# EAGLE design SparkFun_I2S_Audio_Breakout (EAGLE 9.1.1)
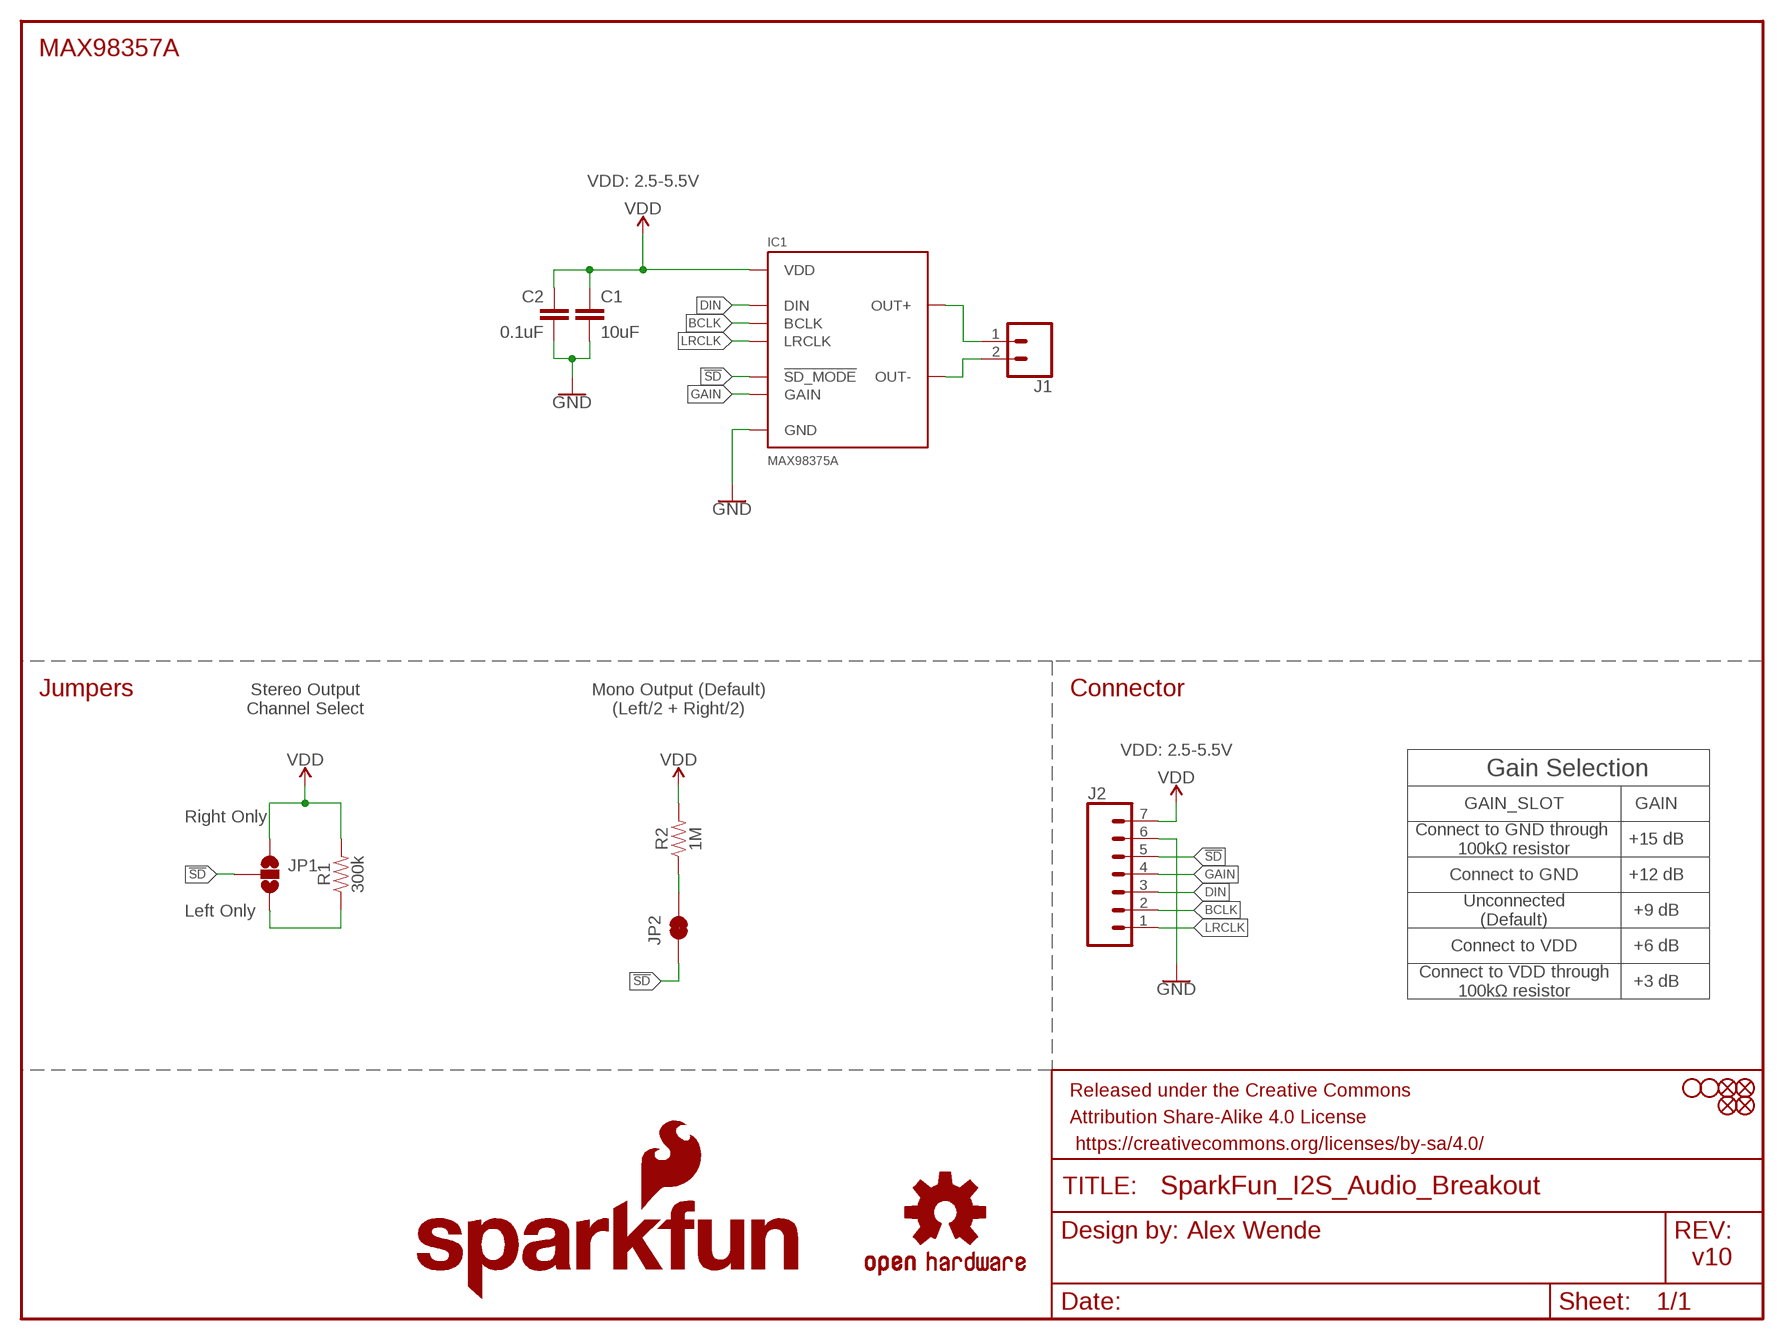
[diagram p0: schematic, sheet 1]

## Parts
C1  10uF  10UF-0805-10V-10%  [0805]
C2  0.1uF  0.1UF-0603-25V-(+80/-20%)  [0603]
FD1  FIDUCIALUFIDUCIAL  [FIDUCIAL-MICRO]
FD2  FIDUCIALUFIDUCIAL  [FIDUCIAL-MICRO]
FD3  FIDUCIALUFIDUCIAL  [FIDUCIAL-MICRO]
FD4  FIDUCIALUFIDUCIAL  [FIDUCIAL-MICRO]
FRAME1  FRAME-LETTER  [CREATIVE_COMMONS]
H1  STAND-OFF  [STAND-OFF]
H2  STAND-OFF  [STAND-OFF]
IC1  MAX98375A  MAX98357A  [TQFN-16]
J1  CONN_023.5MM-NO_SILK  [SCREWTERMINAL-3.5MM-2-NS]
J2  CONN_07NO_SILK  [1X07_NO_SILK]
JP1  JUMPER-SMT_3_NO_NO-SILK  [SMT-JUMPER_3_NO_NO-SILK]
JP2  JUMPER-SMT_2_NC_TRACE_NO-SILK  [SMT-JUMPER_2_NC_TRACE_NO-SILK]
LOGO1  SFE_LOGO_NAME_FLAME.1_INCH  [SFE_LOGO_NAME_FLAME_.1]
LOGO2  OSHW-LOGOS  [OSHW-LOGO-S]
R1  300k  300KOHM-0603-1/10W-1%  [0603]
R2  1M  1MOHM-0603-1/4W-5%  [0603]

## Nets
!SD: IC1.P$4(!SD_MODE) J2.5 JP1.2 JP2.1
BCLK: IC1.P$16(BCLK) J2.2
DIN: IC1.P$1(DIN) J2.3
GAIN: IC1.P$2(GAIN) J2.4
GND: C1.2 C2.2 IC1.P$3(GND) IC1.P$11(GND) IC1.P$15(GND) IC1.P$EP(GND) J2.6
LRCLK: IC1.P$14(LRCLK) J2.1
N$7: JP2.2 R2.1
N$9: JP1.3 R1.1
OUT+: IC1.P$9(OUT+) J1.1
OUT-: IC1.P$10(OUT-) J1.2
VDD: C1.1 C2.1 IC1.P$7(VDD) IC1.P$8(VDD) J2.7 JP1.1 R1.2 R2.2

## Notes on the sheet
- MAX98357A
- VDD: 2.5-5.5V
- Jumpers | Connector
- Stereo Output
  Channel Select
- Mono Output (Default)
  (Left/2 + Right/2)
- VDD: 2.5-5.5V
- Gain Selection
- GAIN_SLOT | GAIN
- Right Only
- Connect to GND through 
  100kΩ resistor
- +15 dB
- Connect to GND | +12 dB
- Unconnected
  (Default)
- +9 dB
- Left Only
- Connect to VDD | +6 dB
- Connect to VDD through
  100kΩ resistor
- +3 dB
- Alex Wende
- v10

## Library data of the parts
C1 = SparkFun-Capacitors:10UF: 10.0µF ceramic capacitors A capacitor is a passive two-terminal electrical component used to store electrical energy temporarily in an electric field.; PROD_ID: CAP-11330
C2 = SparkFun-Capacitors:0.1UF: 0.1µF ceramic capacitors A capacitor is a passive two-terminal electrical component used to store electrical energy temporarily in an electric field.; PROD_ID: CAP-00810
FD1-FD4 = SparkFun-Aesthetics:FIDUCIAL: Fiducial Alignment Points Point-of-reference for pick-and-place machines and other optical instruments.
FRAME1 = SparkFun-Aesthetics:FRAME-LETTER: Schematic Frame - Letter Standard 8.5x11 US Letter frame
H1 H2 = SparkFun-Hardware:STAND-OFF: Stand Off Drill holes for mechanically mounting via screws, standoffs, etc. Note: Use the keepout ring to avoid running the screw head into surrounding components. Variant Overviews STAND-OFF - Mechanical footprint for a #4 phillips button head screw. STAND-OFF-TIGHT - Mechanical footprint for a #4 phillips button head screw, Example SparkFun Products Screw - Phillips Head (1/4", 4-40, 10 pack) <https://www.sparkfun.com/products/10453> (PRT-10453) Screw - Phillips Head (1/2", 4-40, 10 pack) <https://www.sparkfun.com/products/10452> (PRT-10452) Screw - Phillips Head (3/4", 4-40, 10 pack) <https://www.sparkfun.com/products/10451> (PRT-10451) Screw - Phillips Head (1", 4-40, 10 pack) <https://www.sparkfun.com/products/10450> (PRT-10450)
IC1 = SparkFun-IC-Amplifiers:MAX98357A: I2S DAC 3.2W (4-8ohm); PROD_ID: IC-14032
J1 = SparkFun-Connectors:CONN_02: Multi connection point. Often used as Generic Header-pin footprint for 0.1 inch spaced/style header connections On any of the 0.1 inch spaced packages, you can populate with these: Break Away Headers - Straight <https://www.sparkfun.com/products/116> (PRT-00116) Break Away Male Headers - Right Angle <https://www.sparkfun.com/products/553> (PRT-00553) Female Headers <https://www.sparkfun.com/products/115> (PRT-00115) Break Away Headers - Machine Pin <https://www.sparkfun.com/products/117> (PRT-00117) Break Away Female Headers - Swiss Machine Pin <https://www.sparkfun.com/products/743> (PRT-00743) For SCREWTERMINALS and SPRING TERMINALS visit here: Screw Terimnals on SparkFun.com <https://www.sparkfun.com/search/results?term=Screw+Terminals> (5mm/3.5mm/2.54mm spacing) This device is also useful as a general connection point to wire up your design to another part of your project. Our various solder wires solder well into these plated through hole pads. Hook-Up Wire - Assortment (Stranded, 22 AWG) <https://www.sparkfun.com/products/11375> (PRT-11375) Hook-Up Wire - Assortment (Solid Core, 22 AWG) <https://www.sparkfun.com/products/11367> (PRT-11367) View the entire wire category on our website here <https://www.sparkfun.com/categories/141> Special notes: Molex polarized connector foot print use with: PRT-08233 with associated crimp pins and housings. 2.54_SCREWTERM for use with PRT-10571. 3.5mm Screw Terminal footprints for PRT-08084 5mm Screw Terminal footprints for use with PRT-08432; PROD_ID: CONN-08399
J2 = SparkFun-Connectors:CONN_07: Multi connection point. Often used as Generic Header-pin footprint for 0.1 inch spaced/style header connections On any of the 0.1 inch spaced packages, you can populate with these: Break Away Headers - Straight <https://www.sparkfun.com/products/116> (PRT-00116) Break Away Male Headers - Right Angle <https://www.sparkfun.com/products/553> (PRT-00553) Female Headers <https://www.sparkfun.com/products/115> (PRT-00115) Break Away Headers - Machine Pin <https://www.sparkfun.com/products/117> (PRT-00117) Break Away Female Headers - Swiss Machine Pin <https://www.sparkfun.com/products/743> (PRT-00743) For SCREWTERMINALS and SPRING TERMINALS visit here: Screw Terimnals on SparkFun.com <https://www.sparkfun.com/search/results?term=Screw+Terminals> (5mm/3.5mm/2.54mm spacing) This device is also useful as a general connection point to wire up your design to another part of your project. Our various solder wires solder well into these plated through hole pads. Hook-Up Wire - Assortment (Stranded, 22 AWG) <https://www.sparkfun.com/products/11375> (PRT-11375) Hook-Up Wire - Assortment (Solid Core, 22 AWG) <https://www.sparkfun.com/products/11367> (PRT-11367) View the entire wire category on our website here <https://www.sparkfun.com/categories/141> Special notes: Molex polarized connector foot print use with SKU : PRT-08231 with associated crimp pins and housings. 1MM SMD Version SKU: PRT-10208 NOTES ON THE VARIANTS LOCK and LOCK_LONGPADS... This footprint was designed to help hold the alignment of a through-hole component (i.e. 6-pin header) while soldering it into place. You may notice that each hole has been shifted either up or down by 0.005 of an inch from it's more standard position (which is a perfectly straight line). This slight alteration caused the pins (the squares in the middle) to touch the edges of the holes. Because they are alternating, it causes a "brace" to hold the component in place. 0.005 has proven to be the perfect amount of "off-center" position when using our standard breakaway headers. Although looks a little odd when you look at the bare footprint, once you have a header in there, the alteration is very hard to notice. Also,if you push a header all the way into place, it is covered up entirely on the bottom side.
JP1 = SparkFun-Jumpers:JUMPER-SMT_3_NO: Normally open jumper This jumper has three pads in close proximity to each other. Apply solder to close the connection(s).
JP2 = SparkFun-Jumpers:JUMPER-SMT_2_NC_TRACE: Normally closed trace jumper This jumper has a trace between two pads so it's normally closed (NC). Use a razor knife to open the connection. For best results follow the IPC guidelines for cutting traces: Cutout at least 0.063 mm (0.005 in). Remove all loose material to clean up the cut area. Seal the cut with an approved epoxy. Reapply solder to reclose the connection.
LOGO1 = SparkFun-Aesthetics:SFE_LOGO_NAME_FLAME: SparkFun Font Logo w/ Flame This is the SparkFun full logo. The logo on the schematic will always be the same size; the package variant is the height of the flame part of the logo. Default layer for the logo on the board is tSilk.
LOGO2 = SparkFun-Aesthetics:OSHW-LOGO: Open-Source Hardware (OSHW) Logo This logo indicates the piece of hardware it is found on incorporates a OSHW license and/or adheres to the definition of open source hardware found here: http://freedomdefined.org/OSHW
R1 = SparkFun-Resistors:300KOHM: 300kΩ resistor A resistor is a passive two-terminal electrical component that implements electrical resistance as a circuit element. Resistors act to reduce current flow, and, at the same time, act to lower voltage levels within circuits. - Wikipedia; PROD_ID: RES-10809
R2 = SparkFun-Resistors:1MOHM: 1MΩ resistor A resistor is a passive two-terminal electrical component that implements electrical resistance as a circuit element. Resistors act to reduce current flow, and, at the same time, act to lower voltage levels within circuits. - Wikipedia; PROD_ID: RES-07868

## Board
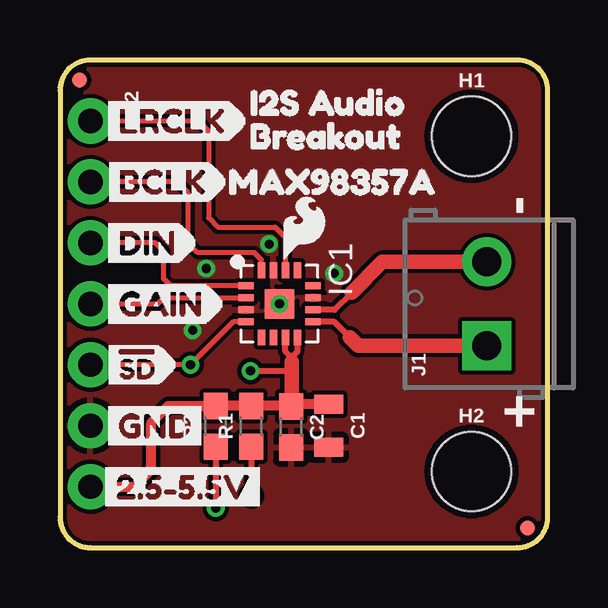
[diagram p1: board, top side]
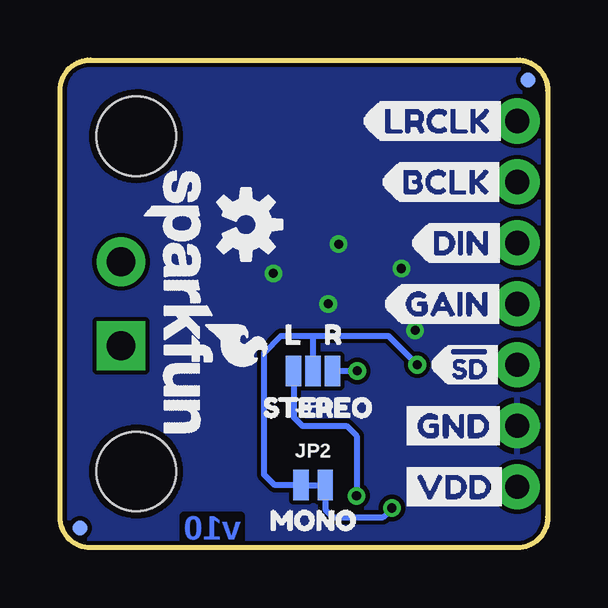
[diagram p2: board, bottom side, seen from below]

Size 20.32 x 20.32 mm. Coordinates in mm from the lower left corner, seen from the top.
Outline: 1.27,0 19.05,0 arc90 20.32,1.27 20.32,19.05 arc90 19.05,20.32 1.27,20.32 arc90 0,19.05 0,1.27 arc90 1.27,0
Copper layers (1*16): Top 0.035mm / dielectric 1.5mm / Bottom 0.035mm
Design rules "SparkFun-2-layer-TIGHT": minimum track width 7mil, minimum drill 15mil, track to track 7mil, track to pad 7mil, pad to pad 7mil, via to via 7mil, smd to smd 7mil, copper to edge 7mil, drill to drill 7mil, minimum pad ring 7mil, minimum via ring 7mil, stop-mask expansion 4mil, vias tented up to drill 25mil, thermal gap 10mil
tRestrict: 4 lines

### Footprints (pad centres in the part's own frame; a part is rotated, then mirrored left to right if it is on the bottom)
0805 = smd 0.8 x 1.2: 1 -0.9,0; 2 0.9,0
0603 = smd 1.1 x 1: 1 -0.85,0; 2 0.85,0
FIDUCIAL-MICRO = smd 0.635 x 0.635: 1 0,0
STAND-OFF = hole 3.302: 0,0
TQFN-16 = smd 0.3 x 0.65: P$1 -0.75,-1.4; P$2 -0.25,-1.4; P$3 0.25,-1.4; P$4 0.75,-1.4; P$9 0.75,1.4; P$10 0.25,1.4; P$11 -0.25,1.4; P$12 -0.75,1.4 | smd 0.65 x 0.3: P$5 1.4,-0.75; P$6 1.4,-0.25; P$7 1.4,0.25; P$8 1.4,0.75; P$13 -1.4,0.75; P$14 -1.4,0.25; P$15 -1.4,-0.25; P$16 -1.4,-0.75 | smd 1.23 x 1.23: P$EP 0,0
SCREWTERMINAL-3.5MM-2-NS = drill 1.2 pad 2.032 square: 1 0,0 | drill 1.2 pad 2.032: 2 3.5,0
1X07_NO_SILK = drill 1.016 pad 1.88: 1 0,0; 2 2.54,0; 3 5.08,0; 4 7.62,0; 5 10.16,0; 6 12.7,0; 7 15.24,0
SMT-JUMPER_3_NO_NO-SILK = smd 0.635 x 1.27: 1 -0.813,0; 2 0,0; 3 0.813,0
SMT-JUMPER_2_NC_TRACE_NO-SILK = smd 0.635 x 1.27: 1 -0.508,0; 2 0.508,0

### Placement (x,y rotation side)
C1  11.2,5.08 270 top
C2  9.63,5.03 270 top
FD1  19.48,0.81 0 top
FD2  0.81,19.48 0 top
FD3  19.48,0.81 0 bottom
FD4  0.81,19.48 0 bottom
H1  17.14,17.14 0 top
H2  17.14,3.17 0 top
IC1  9.14,10.16 270 top
J1  17.78,8.41 90 top
J2  1.27,17.78 270 top
JP1  9.78,7.37 180 bottom
JP2  9.78,2.6 0 bottom
LOGO1  16.89,16.13 270 bottom
LOGO2  12.57,13.46 270 bottom
R1  7.96,5.05 90 top
R2  6.49,5.05 90 top
U$1  [2#5#5#5V13]  1.4,2.54 0 top
U$2  [GND9]  1.52,5.08 0 top
U$3  [#SD7]  1.4,7.62 0 top
U$4  [GAIN6]  1.52,10.16 0 top
U$5  [DIN5]  1.52,12.7 0 top
U$6  [BCLK4]  1.52,15.24 0 top
U$7  [LRCLK3]  1.52,17.78 0 top
U$8  [I2S_AUDIO0]  6.99,18.54 0 top
U$9  [BREAKOUT1]  6.99,17.14 0 top
U$10  [MAX98357A2]  6.1,15.24 0 top
U$11  [LRCLK0]  7.75,17.78 0 bottom
U$12  [BCLK1]  6.99,15.24 0 bottom
U$13  [DIN2]  5.71,12.7 0 bottom
U$14  [GAIN3]  6.86,10.16 0 bottom
U$15  [SFE_LOGO_FLAME_.1]  9.02,11.68 0 top
U$16  [MONO12]  12.32,1.14 0 bottom
U$17  [L10]  11.68,8.89 0 bottom
U$18  [R11]  10.03,8.89 0 bottom
U$19  [STEREO14]  12.57,5.84 0 bottom
U$20  [#SD4]  5.08,7.62 0 bottom
U$22  [VDD8]  6.35,2.54 0 bottom
U$23  [GND9]  6.35,5.08 0 bottom

### Tracks (layer width: path | path; a pad name or v marks a point on that pad's centre or on a via)
!SD  (via drill 0.38)
  Top 0.203: IC1.P$4 7.23,9.41 v5.44,7.62 J2.5
  Bottom 0.254: JP1.2 9.78,8.83 | JP2.1 11.37,2.6 11.81,3.05 11.81,8.13 11.11,8.83 10.16,8.83 9.78,8.83 | 9.78,8.83 6.64,8.83 v5.44,7.62
BCLK
  Top 0.203: IC1.P$16 8.39,12 8.1,12.29 5.74,12.29 5.33,12.7 5.33,14.78 4.88,15.24 J2.2
DIN
  Top 0.203: IC1.P$1 4.61,10.91 4.31,11.21 4.31,12.35 3.96,12.7 J2.3
GAIN
  Top 0.203: J2.4 4.06,10.16 4.31,10.41 IC1.P$2
GND  (via drill 0.38)
  other vias: 9.14,10.16 8.71,12.65 6.1,11.63 5.52,9.06 11.43,11.43
  pour Top: 0,20.32 20.32,20.32 20.32,0 0,0
  pour Bottom: 0,20.32 20.32,20.32 20.32,0 0,0
LRCLK
  Top 0.203: J2.1 5.77,17.78 6.2,17.35 6.2,13.74 6.58,13.36 8.97,13.36 9.39,12.93 IC1.P$14
N$7  (via drill 0.38)
  Top 0.254: R2.1 v6.49,1.65
  Bottom 0.254: JP2.2 9.27,1.58 8.95,1.27 6.86,1.27 6.49,1.64 v6.49,1.65
N$9  (via drill 0.38)
  Top 0.254: R1.1 v7.96,2.16
  Bottom 0.254: JP1.3 10.59,5.44 10.22,5.08 8.38,5.08 7.96,4.66 v7.96,2.16
OUT+
  Top 0.254: 12.06,8.76 11.42,9.41 IC1.P$9
  Top 0.61: J1.1 12.42,8.41 12.06,8.76
OUT-
  Top 0.254: 12.15,10.63 11.43,9.91 IC1.P$10
  Top 0.61: J1.2 13.43,11.91 12.15,10.63
VDD  (via drill 0.38)
  Top 0.254: IC1.P$8 9.89,8.17 9.65,7.92 | 9.65,7.92 9.39,8.18 IC1.P$7 | 9.65,7.92 9.65,7.75 9.65,7.37 v7.94,7.37 | 9.65,7.94 9.65,7.92
  Top 0.406: C1.1 9.63,5.98 C2.1 9.63,5.91 R1.2 R2.2 | J2.7 3.11,2.54 3.81,3.24 3.81,5.21 4.51,5.91 R2.2 | R2.2
  Top 0.61: C2.1 9.65,5.91 9.65,7.75
  Bottom 0.254: JP1.1 v7.94,7.37

### Text on the board
Bottom: v10
tPlace: - | +